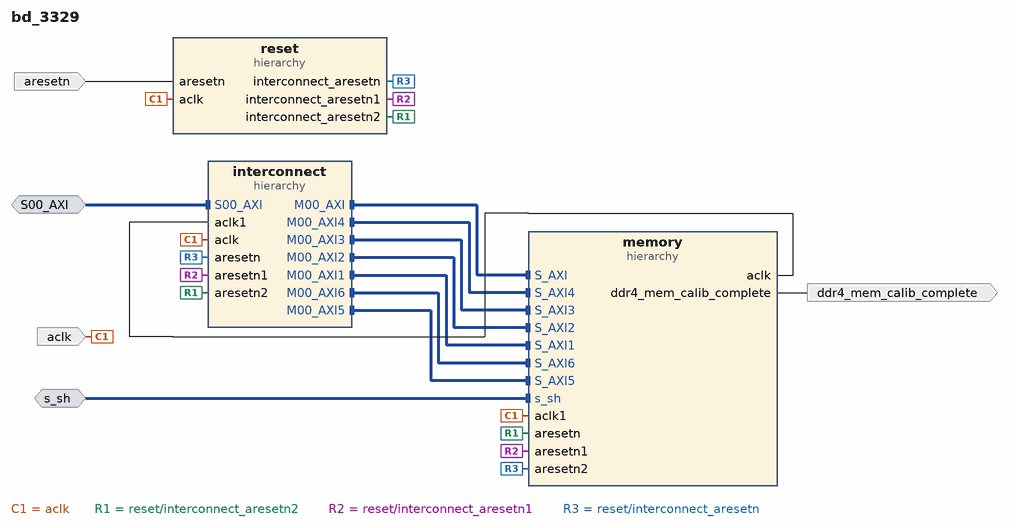
[diagram p0: block diagram of the top level]
# Vivado block design bd_3329, xcvu9p-flgb2104-2-i, Vivado 2019.2
create_bd_design bd_3329

create_bd_intf_port -mode Slave -vlnv xilinx.com:interface:aximm_rtl:1.0 S00_AXI
set_property -dict {CONFIG.ADDR_WIDTH 37 CONFIG.master_id 0} [get_bd_intf_ports S00_AXI]
create_bd_intf_port -mode Slave -vlnv xilinx.com:interface:aws_f1_sh1_rtl:1.0 s_sh
create_bd_port -dir I -type clk aclk
set_property -dict {CONFIG.ASSOCIATED_BUSIF S00_AXI} [get_bd_ports aclk]
create_bd_port -dir I -type rst aresetn
create_bd_port -dir O -type data ddr4_mem_calib_complete

create_bd_cell -type hier reset
create_bd_cell -type hier interconnect
create_bd_cell -type hier memory

# ---- hierarchy /reset ----
current_bd_instance /reset
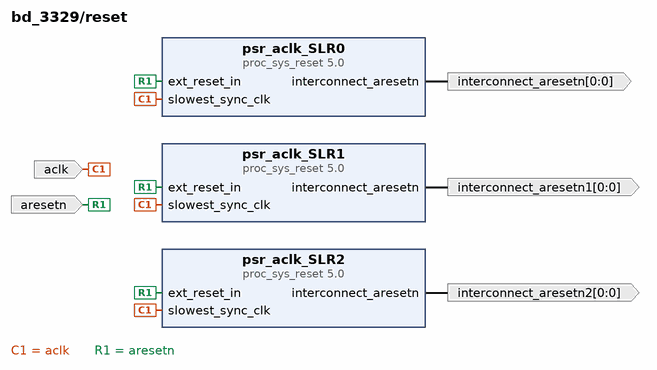
[diagram p1: block diagram inside /reset]
create_bd_pin -dir I -type clk aclk
create_bd_pin -dir I -type rst aresetn
create_bd_pin -dir O -from 0 -to 0 -type rst interconnect_aresetn
create_bd_pin -dir O -from 0 -to 0 -type rst interconnect_aresetn1
create_bd_pin -dir O -from 0 -to 0 -type rst interconnect_aresetn2

create_bd_cell -type ip -vlnv xilinx.com:ip:proc_sys_reset:5.0 psr_aclk_SLR0
set_property -dict {CONFIG.SLR_ASSIGNMENTS SLR0} [get_bd_cells psr_aclk_SLR0]
create_bd_cell -type ip -vlnv xilinx.com:ip:proc_sys_reset:5.0 psr_aclk_SLR1
set_property -dict {CONFIG.SLR_ASSIGNMENTS SLR1} [get_bd_cells psr_aclk_SLR1]
create_bd_cell -type ip -vlnv xilinx.com:ip:proc_sys_reset:5.0 psr_aclk_SLR2
set_property -dict {CONFIG.SLR_ASSIGNMENTS SLR2} [get_bd_cells psr_aclk_SLR2]

# ---- hierarchy /interconnect ----
current_bd_instance /interconnect
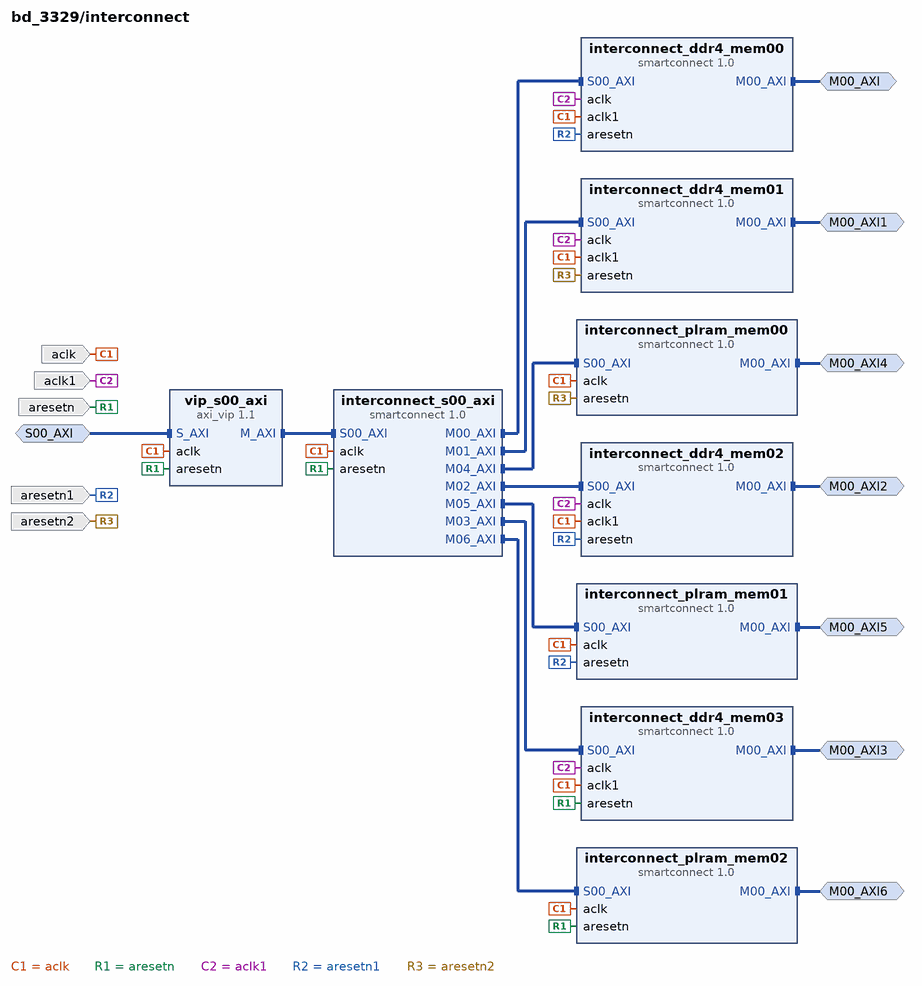
[diagram p2: block diagram inside /interconnect]
create_bd_intf_pin -mode Master -vlnv xilinx.com:interface:aximm_rtl:1.0 M00_AXI
create_bd_intf_pin -mode Master -vlnv xilinx.com:interface:aximm_rtl:1.0 M00_AXI1
create_bd_intf_pin -mode Master -vlnv xilinx.com:interface:aximm_rtl:1.0 M00_AXI2
create_bd_intf_pin -mode Master -vlnv xilinx.com:interface:aximm_rtl:1.0 M00_AXI3
create_bd_intf_pin -mode Master -vlnv xilinx.com:interface:aximm_rtl:1.0 M00_AXI4
create_bd_intf_pin -mode Master -vlnv xilinx.com:interface:aximm_rtl:1.0 M00_AXI5
create_bd_intf_pin -mode Master -vlnv xilinx.com:interface:aximm_rtl:1.0 M00_AXI6
create_bd_intf_pin -mode Slave -vlnv xilinx.com:interface:aximm_rtl:1.0 S00_AXI
create_bd_pin -dir I -type clk aclk
create_bd_pin -dir I -type rst aresetn
create_bd_pin -dir I -type clk aclk1
create_bd_pin -dir I -type rst aresetn1
create_bd_pin -dir I -type rst aresetn2

create_bd_cell -type ip -vlnv xilinx.com:ip:smartconnect:1.0 interconnect_s00_axi
set_property -dict [list \
  CONFIG.ADVANCED_PROPERTIES {__view__ {functional {S00_Buffer {R_SIZE 512 W_SIZE 512}} timing {M00_Buffer {AR_SLR_PIPE 2 AW_SLR_PIPE 2 R_SLR_PIPE 2 W_SLR_PIPE 2 B_SLR_PIPE 2} M01_Buffer {AR_SLR_PIPE 3 AW_SLR_PIPE 3 R_SLR_PIPE 3 W_SLR_PIPE 3 B_SLR_PIPE 3} M02_Buffer {AR_SLR_PIPE 2 AW_SLR_PIPE 2 R_SLR_PIPE 2 W_SLR_PIPE 2 B_SLR_PIPE 2} M04_Buffer {AR_SLR_PIPE 3 AW_SLR_PIPE 3 R_SLR_PIPE 3 W_SLR_PIPE 3 B_SLR_PIPE 3} M05_Buffer {AR_SLR_PIPE 2 AW_SLR_PIPE 2 R_SLR_PIPE 2 W_SLR_PIPE 2 B_SLR_PIPE 2}}}} \
  CONFIG.NUM_MI 7 \
  CONFIG.NUM_SI 1 \
] [get_bd_cells interconnect_s00_axi]
create_bd_cell -type ip -vlnv xilinx.com:ip:smartconnect:1.0 interconnect_ddr4_mem00
set_property -dict [list \
  CONFIG.ADVANCED_PROPERTIES {__view__ {timing {M00_Buffer {R_SLR_PIPE 1 R_M_SEND_PIPE 1} M00_Exit {REGSLICE 0}}}} \
  CONFIG.NUM_CLKS 2 \
  CONFIG.NUM_MI 1 \
  CONFIG.NUM_SI 1 \
] [get_bd_cells interconnect_ddr4_mem00]
create_bd_cell -type ip -vlnv xilinx.com:ip:smartconnect:1.0 interconnect_ddr4_mem01
set_property -dict [list \
  CONFIG.ADVANCED_PROPERTIES {__view__ {timing {M00_Buffer {R_SLR_PIPE 1 R_M_SEND_PIPE 1} M00_Exit {REGSLICE 0}}}} \
  CONFIG.NUM_CLKS 2 \
  CONFIG.NUM_MI 1 \
  CONFIG.NUM_SI 1 \
] [get_bd_cells interconnect_ddr4_mem01]
create_bd_cell -type ip -vlnv xilinx.com:ip:smartconnect:1.0 interconnect_ddr4_mem02
set_property -dict [list \
  CONFIG.ADVANCED_PROPERTIES {__view__ {timing {M00_Buffer {R_SLR_PIPE 1 R_M_SEND_PIPE 1} M00_Exit {REGSLICE 0}}}} \
  CONFIG.NUM_CLKS 2 \
  CONFIG.NUM_MI 1 \
  CONFIG.NUM_SI 1 \
] [get_bd_cells interconnect_ddr4_mem02]
create_bd_cell -type ip -vlnv xilinx.com:ip:smartconnect:1.0 interconnect_ddr4_mem03
set_property -dict [list \
  CONFIG.ADVANCED_PROPERTIES {__view__ {timing {M00_Buffer {R_SLR_PIPE 1 R_M_SEND_PIPE 1} M00_Exit {REGSLICE 0}}}} \
  CONFIG.NUM_CLKS 2 \
  CONFIG.NUM_MI 1 \
  CONFIG.NUM_SI 1 \
] [get_bd_cells interconnect_ddr4_mem03]
create_bd_cell -type ip -vlnv xilinx.com:ip:smartconnect:1.0 interconnect_plram_mem00
set_property -dict [list \
  CONFIG.ADVANCED_PROPERTIES {__view__ {timing {M00_Buffer {R_SLR_PIPE 1 R_M_SEND_PIPE 1} M00_Exit {REGSLICE 0}}}} \
  CONFIG.NUM_CLKS 1 \
  CONFIG.NUM_MI 1 \
  CONFIG.NUM_SI 1 \
] [get_bd_cells interconnect_plram_mem00]
create_bd_cell -type ip -vlnv xilinx.com:ip:smartconnect:1.0 interconnect_plram_mem01
set_property -dict [list \
  CONFIG.ADVANCED_PROPERTIES {__view__ {timing {M00_Buffer {R_SLR_PIPE 1 R_M_SEND_PIPE 1} M00_Exit {REGSLICE 0}}}} \
  CONFIG.NUM_CLKS 1 \
  CONFIG.NUM_MI 1 \
  CONFIG.NUM_SI 1 \
] [get_bd_cells interconnect_plram_mem01]
create_bd_cell -type ip -vlnv xilinx.com:ip:smartconnect:1.0 interconnect_plram_mem02
set_property -dict [list \
  CONFIG.ADVANCED_PROPERTIES {__view__ {timing {M00_Buffer {R_SLR_PIPE 1 R_M_SEND_PIPE 1} M00_Exit {REGSLICE 0}}}} \
  CONFIG.NUM_CLKS 1 \
  CONFIG.NUM_MI 1 \
  CONFIG.NUM_SI 1 \
] [get_bd_cells interconnect_plram_mem02]
create_bd_cell -type ip -vlnv xilinx.com:ip:axi_vip:1.1 vip_s00_axi

# ---- hierarchy /memory ----
current_bd_instance /memory
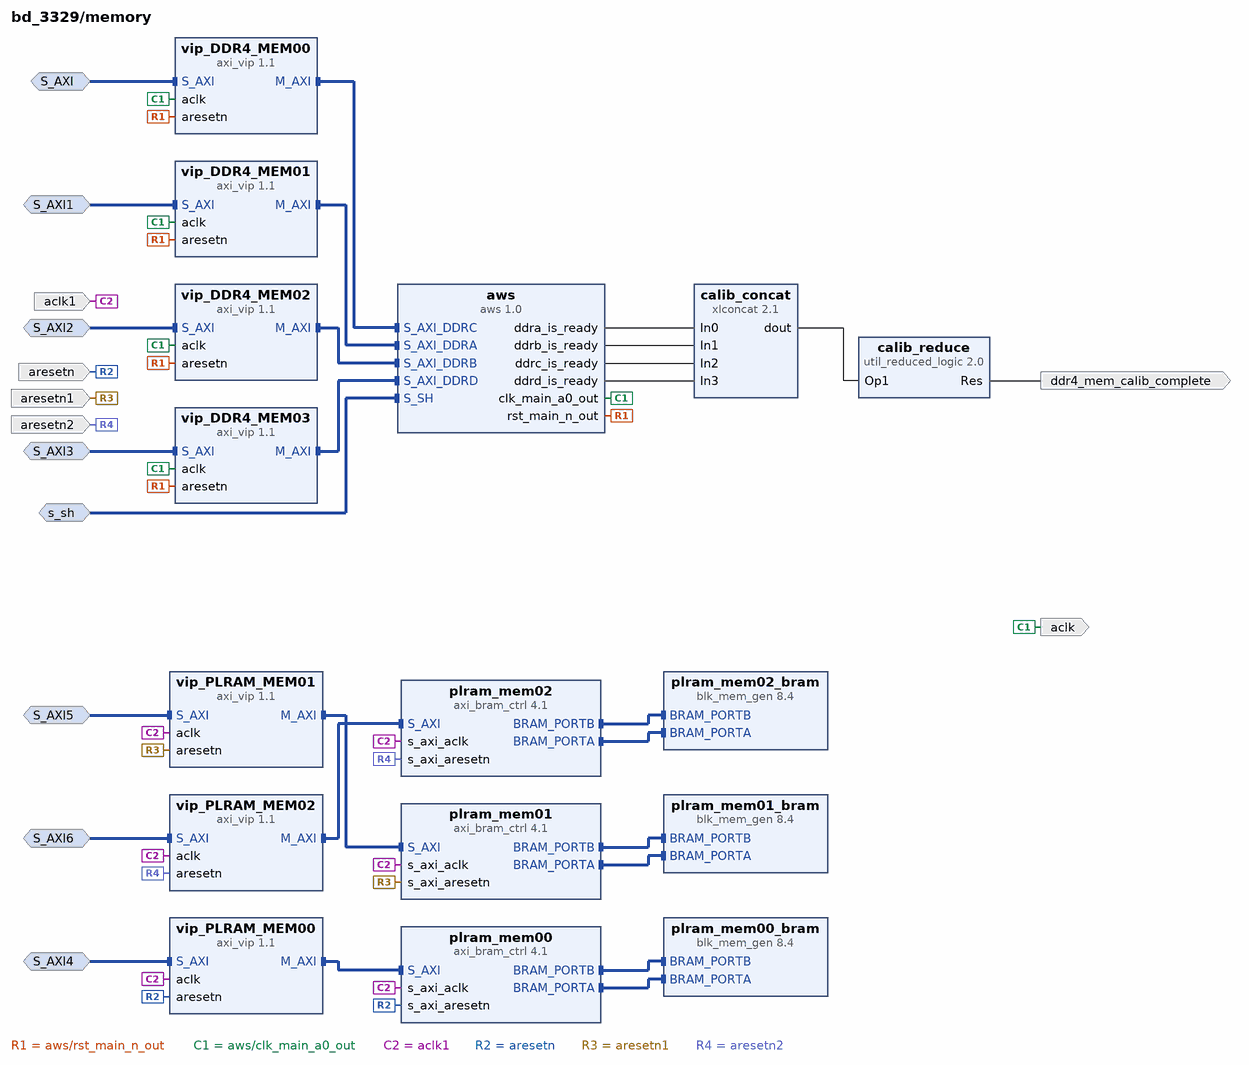
[diagram p3: block diagram inside /memory]
create_bd_intf_pin -mode Slave -vlnv xilinx.com:interface:aws_f1_sh1_rtl:1.0 s_sh
create_bd_intf_pin -mode Slave -vlnv xilinx.com:interface:aximm_rtl:1.0 S_AXI
create_bd_intf_pin -mode Slave -vlnv xilinx.com:interface:aximm_rtl:1.0 S_AXI1
create_bd_intf_pin -mode Slave -vlnv xilinx.com:interface:aximm_rtl:1.0 S_AXI2
create_bd_intf_pin -mode Slave -vlnv xilinx.com:interface:aximm_rtl:1.0 S_AXI3
create_bd_intf_pin -mode Slave -vlnv xilinx.com:interface:aximm_rtl:1.0 S_AXI4
create_bd_intf_pin -mode Slave -vlnv xilinx.com:interface:aximm_rtl:1.0 S_AXI5
create_bd_intf_pin -mode Slave -vlnv xilinx.com:interface:aximm_rtl:1.0 S_AXI6
create_bd_pin -dir O -type clk aclk
create_bd_pin -dir O ddr4_mem_calib_complete
create_bd_pin -dir I -type clk aclk1
create_bd_pin -dir I -type rst aresetn
create_bd_pin -dir I -type rst aresetn1
create_bd_pin -dir I -type rst aresetn2

create_bd_cell -type ip -vlnv xilinx.com:ip:aws:1.0 aws
set_property -dict [list \
  CONFIG.DDR_A_PRESENT 1 \
  CONFIG.DDR_B_PRESENT 1 \
  CONFIG.DDR_C_PRESENT 1 \
  CONFIG.DDR_D_PRESENT 1 \
  CONFIG.MODE 1 \
] [get_bd_cells aws]
create_bd_cell -type ip -vlnv xilinx.com:ip:xlconcat:2.1 calib_concat
set_property -dict {CONFIG.NUM_PORTS 4} [get_bd_cells calib_concat]
create_bd_cell -type ip -vlnv xilinx.com:ip:util_reduced_logic:2.0 calib_reduce
set_property -dict {CONFIG.C_OPERATION and CONFIG.C_SIZE 4} [get_bd_cells calib_reduce]
create_bd_cell -type ip -vlnv xilinx.com:ip:axi_bram_ctrl:4.1 plram_mem00
set_property -dict {CONFIG.DATA_WIDTH 512 CONFIG.SLR_ASSIGNMENTS SLR2} [get_bd_cells plram_mem00]
create_bd_cell -type ip -vlnv xilinx.com:ip:blk_mem_gen:8.4 plram_mem00_bram
set_property -dict {CONFIG.Memory_Type True_Dual_Port_RAM CONFIG.SLR_ASSIGNMENTS SLR2} [get_bd_cells plram_mem00_bram]
create_bd_cell -type ip -vlnv xilinx.com:ip:axi_bram_ctrl:4.1 plram_mem01
set_property -dict {CONFIG.DATA_WIDTH 512 CONFIG.SLR_ASSIGNMENTS SLR1} [get_bd_cells plram_mem01]
create_bd_cell -type ip -vlnv xilinx.com:ip:blk_mem_gen:8.4 plram_mem01_bram
set_property -dict {CONFIG.Memory_Type True_Dual_Port_RAM CONFIG.SLR_ASSIGNMENTS SLR1} [get_bd_cells plram_mem01_bram]
create_bd_cell -type ip -vlnv xilinx.com:ip:axi_bram_ctrl:4.1 plram_mem02
set_property -dict {CONFIG.DATA_WIDTH 512 CONFIG.SLR_ASSIGNMENTS SLR0} [get_bd_cells plram_mem02]
create_bd_cell -type ip -vlnv xilinx.com:ip:blk_mem_gen:8.4 plram_mem02_bram
set_property -dict {CONFIG.Memory_Type True_Dual_Port_RAM CONFIG.SLR_ASSIGNMENTS SLR0} [get_bd_cells plram_mem02_bram]
create_bd_cell -type ip -vlnv xilinx.com:ip:axi_vip:1.1 vip_DDR4_MEM00
create_bd_cell -type ip -vlnv xilinx.com:ip:axi_vip:1.1 vip_DDR4_MEM01
create_bd_cell -type ip -vlnv xilinx.com:ip:axi_vip:1.1 vip_DDR4_MEM02
create_bd_cell -type ip -vlnv xilinx.com:ip:axi_vip:1.1 vip_DDR4_MEM03
create_bd_cell -type ip -vlnv xilinx.com:ip:axi_vip:1.1 vip_PLRAM_MEM00
create_bd_cell -type ip -vlnv xilinx.com:ip:axi_vip:1.1 vip_PLRAM_MEM01
create_bd_cell -type ip -vlnv xilinx.com:ip:axi_vip:1.1 vip_PLRAM_MEM02

# ---- connections ----

current_bd_instance /reset
connect_bd_net [get_bd_pins aclk] \
  [get_bd_pins psr_aclk_SLR1/slowest_sync_clk] [get_bd_pins psr_aclk_SLR2/slowest_sync_clk] \
  [get_bd_pins psr_aclk_SLR0/slowest_sync_clk]
connect_bd_net [get_bd_pins aresetn] \
  [get_bd_pins psr_aclk_SLR1/ext_reset_in] [get_bd_pins psr_aclk_SLR2/ext_reset_in] [get_bd_pins psr_aclk_SLR0/ext_reset_in]
connect_bd_net [get_bd_pins psr_aclk_SLR0/interconnect_aresetn] [get_bd_pins interconnect_aresetn]
connect_bd_net [get_bd_pins psr_aclk_SLR1/interconnect_aresetn] [get_bd_pins interconnect_aresetn1]
connect_bd_net [get_bd_pins psr_aclk_SLR2/interconnect_aresetn] [get_bd_pins interconnect_aresetn2]

current_bd_instance /interconnect
connect_bd_intf_net [get_bd_intf_pins interconnect_s00_axi/S00_AXI] [get_bd_intf_pins vip_s00_axi/M_AXI]
connect_bd_intf_net [get_bd_intf_pins M00_AXI4] [get_bd_intf_pins interconnect_plram_mem00/M00_AXI]
connect_bd_intf_net [get_bd_intf_pins S00_AXI] [get_bd_intf_pins vip_s00_axi/S_AXI]
connect_bd_intf_net [get_bd_intf_pins M00_AXI6] [get_bd_intf_pins interconnect_plram_mem02/M00_AXI]
connect_bd_intf_net [get_bd_intf_pins M00_AXI1] [get_bd_intf_pins interconnect_ddr4_mem01/M00_AXI]
connect_bd_intf_net [get_bd_intf_pins M00_AXI2] [get_bd_intf_pins interconnect_ddr4_mem02/M00_AXI]
connect_bd_intf_net [get_bd_intf_pins M00_AXI3] [get_bd_intf_pins interconnect_ddr4_mem03/M00_AXI]
connect_bd_intf_net [get_bd_intf_pins M00_AXI] [get_bd_intf_pins interconnect_ddr4_mem00/M00_AXI]
connect_bd_intf_net [get_bd_intf_pins M00_AXI5] [get_bd_intf_pins interconnect_plram_mem01/M00_AXI]
connect_bd_intf_net [get_bd_intf_pins interconnect_s00_axi/M05_AXI] [get_bd_intf_pins interconnect_plram_mem01/S00_AXI]
connect_bd_intf_net [get_bd_intf_pins interconnect_s00_axi/M06_AXI] [get_bd_intf_pins interconnect_plram_mem02/S00_AXI]
connect_bd_intf_net [get_bd_intf_pins interconnect_s00_axi/M02_AXI] [get_bd_intf_pins interconnect_ddr4_mem02/S00_AXI]
connect_bd_intf_net [get_bd_intf_pins interconnect_s00_axi/M03_AXI] [get_bd_intf_pins interconnect_ddr4_mem03/S00_AXI]
connect_bd_intf_net [get_bd_intf_pins interconnect_s00_axi/M04_AXI] [get_bd_intf_pins interconnect_plram_mem00/S00_AXI]
connect_bd_intf_net [get_bd_intf_pins interconnect_s00_axi/M00_AXI] [get_bd_intf_pins interconnect_ddr4_mem00/S00_AXI]
connect_bd_intf_net [get_bd_intf_pins interconnect_s00_axi/M01_AXI] [get_bd_intf_pins interconnect_ddr4_mem01/S00_AXI]
connect_bd_net [get_bd_pins aclk] \
  [get_bd_pins interconnect_ddr4_mem00/aclk1] [get_bd_pins interconnect_ddr4_mem01/aclk1] \
  [get_bd_pins interconnect_ddr4_mem02/aclk1] [get_bd_pins interconnect_ddr4_mem03/aclk1] \
  [get_bd_pins interconnect_plram_mem00/aclk] [get_bd_pins interconnect_plram_mem01/aclk] \
  [get_bd_pins interconnect_plram_mem02/aclk] [get_bd_pins vip_s00_axi/aclk] [get_bd_pins interconnect_s00_axi/aclk]
connect_bd_net -net psr_aclk_SLR0_interconnect_aresetn [get_bd_pins aresetn] \
  [get_bd_pins interconnect_ddr4_mem03/aresetn] [get_bd_pins interconnect_plram_mem02/aresetn] \
  [get_bd_pins vip_s00_axi/aresetn] [get_bd_pins interconnect_s00_axi/aresetn]
connect_bd_net -net aws_clk_main_a0_out [get_bd_pins aclk1] \
  [get_bd_pins interconnect_ddr4_mem01/aclk] [get_bd_pins interconnect_ddr4_mem02/aclk] \
  [get_bd_pins interconnect_ddr4_mem03/aclk] [get_bd_pins interconnect_ddr4_mem00/aclk]
connect_bd_net -net psr_aclk_SLR1_interconnect_aresetn [get_bd_pins aresetn1] \
  [get_bd_pins interconnect_ddr4_mem02/aresetn] [get_bd_pins interconnect_plram_mem01/aresetn] \
  [get_bd_pins interconnect_ddr4_mem00/aresetn]
connect_bd_net -net psr_aclk_SLR2_interconnect_aresetn [get_bd_pins aresetn2] \
  [get_bd_pins interconnect_plram_mem00/aresetn] [get_bd_pins interconnect_ddr4_mem01/aresetn]

current_bd_instance /memory
connect_bd_intf_net [get_bd_intf_pins aws/S_AXI_DDRC] [get_bd_intf_pins vip_DDR4_MEM00/M_AXI]
connect_bd_intf_net [get_bd_intf_pins plram_mem00/S_AXI] [get_bd_intf_pins vip_PLRAM_MEM00/M_AXI]
connect_bd_intf_net [get_bd_intf_pins aws/S_AXI_DDRD] [get_bd_intf_pins vip_DDR4_MEM03/M_AXI]
connect_bd_intf_net [get_bd_intf_pins aws/S_AXI_DDRB] [get_bd_intf_pins vip_DDR4_MEM02/M_AXI]
connect_bd_intf_net [get_bd_intf_pins aws/S_AXI_DDRA] [get_bd_intf_pins vip_DDR4_MEM01/M_AXI]
connect_bd_intf_net [get_bd_intf_pins plram_mem02/S_AXI] [get_bd_intf_pins vip_PLRAM_MEM02/M_AXI]
connect_bd_intf_net -intf_net interconnect_plram_mem02_M00_AXI [get_bd_intf_pins S_AXI6] [get_bd_intf_pins vip_PLRAM_MEM02/S_AXI]
connect_bd_intf_net -intf_net interconnect_ddr4_mem03_M00_AXI [get_bd_intf_pins S_AXI3] [get_bd_intf_pins vip_DDR4_MEM03/S_AXI]
connect_bd_intf_net -intf_net interconnect_plram_mem01_M00_AXI [get_bd_intf_pins S_AXI5] [get_bd_intf_pins vip_PLRAM_MEM01/S_AXI]
connect_bd_intf_net -intf_net interconnect_ddr4_mem01_M00_AXI [get_bd_intf_pins S_AXI1] [get_bd_intf_pins vip_DDR4_MEM01/S_AXI]
connect_bd_intf_net -intf_net interconnect_ddr4_mem02_M00_AXI [get_bd_intf_pins S_AXI2] [get_bd_intf_pins vip_DDR4_MEM02/S_AXI]
connect_bd_intf_net [get_bd_intf_pins s_sh] [get_bd_intf_pins aws/S_SH]
connect_bd_intf_net -intf_net interconnect_ddr4_mem00_M00_AXI [get_bd_intf_pins S_AXI] [get_bd_intf_pins vip_DDR4_MEM00/S_AXI]
connect_bd_intf_net -intf_net interconnect_plram_mem00_M00_AXI [get_bd_intf_pins S_AXI4] [get_bd_intf_pins vip_PLRAM_MEM00/S_AXI]
connect_bd_intf_net [get_bd_intf_pins plram_mem01/S_AXI] [get_bd_intf_pins vip_PLRAM_MEM01/M_AXI]
connect_bd_intf_net [get_bd_intf_pins plram_mem02_bram/BRAM_PORTB] [get_bd_intf_pins plram_mem02/BRAM_PORTB]
connect_bd_intf_net [get_bd_intf_pins plram_mem02_bram/BRAM_PORTA] [get_bd_intf_pins plram_mem02/BRAM_PORTA]
connect_bd_intf_net [get_bd_intf_pins plram_mem01_bram/BRAM_PORTB] [get_bd_intf_pins plram_mem01/BRAM_PORTB]
connect_bd_intf_net [get_bd_intf_pins plram_mem01_bram/BRAM_PORTA] [get_bd_intf_pins plram_mem01/BRAM_PORTA]
connect_bd_intf_net [get_bd_intf_pins plram_mem00_bram/BRAM_PORTB] [get_bd_intf_pins plram_mem00/BRAM_PORTB]
connect_bd_intf_net [get_bd_intf_pins plram_mem00_bram/BRAM_PORTA] [get_bd_intf_pins plram_mem00/BRAM_PORTA]
connect_bd_net [get_bd_pins aws/rst_main_n_out] \
  [get_bd_pins vip_DDR4_MEM00/aresetn] [get_bd_pins vip_DDR4_MEM01/aresetn] [get_bd_pins vip_DDR4_MEM02/aresetn] \
  [get_bd_pins vip_DDR4_MEM03/aresetn]
connect_bd_net [get_bd_pins aws/ddra_is_ready] [get_bd_pins calib_concat/In0]
connect_bd_net [get_bd_pins aws/ddrb_is_ready] [get_bd_pins calib_concat/In1]
connect_bd_net [get_bd_pins aws/ddrc_is_ready] [get_bd_pins calib_concat/In2]
connect_bd_net [get_bd_pins aws/ddrd_is_ready] [get_bd_pins calib_concat/In3]
connect_bd_net [get_bd_pins calib_concat/dout] [get_bd_pins calib_reduce/Op1]
connect_bd_net [get_bd_pins aws/clk_main_a0_out] \
  [get_bd_pins aclk] [get_bd_pins vip_DDR4_MEM00/aclk] [get_bd_pins vip_DDR4_MEM01/aclk] [get_bd_pins vip_DDR4_MEM02/aclk] \
  [get_bd_pins vip_DDR4_MEM03/aclk]
connect_bd_net [get_bd_pins calib_reduce/Res] [get_bd_pins ddr4_mem_calib_complete]
connect_bd_net [get_bd_pins aclk1] \
  [get_bd_pins plram_mem01/s_axi_aclk] [get_bd_pins plram_mem02/s_axi_aclk] [get_bd_pins vip_PLRAM_MEM00/aclk] \
  [get_bd_pins vip_PLRAM_MEM01/aclk] [get_bd_pins vip_PLRAM_MEM02/aclk] [get_bd_pins plram_mem00/s_axi_aclk]
connect_bd_net -net psr_aclk_SLR2_interconnect_aresetn [get_bd_pins aresetn] \
  [get_bd_pins vip_PLRAM_MEM00/aresetn] [get_bd_pins plram_mem00/s_axi_aresetn]
connect_bd_net -net psr_aclk_SLR1_interconnect_aresetn [get_bd_pins aresetn1] \
  [get_bd_pins vip_PLRAM_MEM01/aresetn] [get_bd_pins plram_mem01/s_axi_aresetn]
connect_bd_net -net psr_aclk_SLR0_interconnect_aresetn [get_bd_pins aresetn2] \
  [get_bd_pins vip_PLRAM_MEM02/aresetn] [get_bd_pins plram_mem02/s_axi_aresetn]

current_bd_instance /
connect_bd_intf_net -intf_net interconnect_ddr4_mem00_M00_AXI [get_bd_intf_pins interconnect/M00_AXI] [get_bd_intf_pins memory/S_AXI]
connect_bd_intf_net -intf_net interconnect_plram_mem00_M00_AXI [get_bd_intf_pins interconnect/M00_AXI4] [get_bd_intf_pins memory/S_AXI4]
connect_bd_intf_net -intf_net interconnect_ddr4_mem03_M00_AXI [get_bd_intf_pins interconnect/M00_AXI3] [get_bd_intf_pins memory/S_AXI3]
connect_bd_intf_net -intf_net interconnect_ddr4_mem02_M00_AXI [get_bd_intf_pins interconnect/M00_AXI2] [get_bd_intf_pins memory/S_AXI2]
connect_bd_intf_net -intf_net interconnect_ddr4_mem01_M00_AXI [get_bd_intf_pins interconnect/M00_AXI1] [get_bd_intf_pins memory/S_AXI1]
connect_bd_intf_net -intf_net interconnect_plram_mem02_M00_AXI [get_bd_intf_pins interconnect/M00_AXI6] [get_bd_intf_pins memory/S_AXI6]
connect_bd_intf_net -intf_net interconnect_plram_mem01_M00_AXI [get_bd_intf_pins interconnect/M00_AXI5] [get_bd_intf_pins memory/S_AXI5]
connect_bd_intf_net [get_bd_intf_ports S00_AXI] [get_bd_intf_pins interconnect/S00_AXI]
connect_bd_intf_net [get_bd_intf_ports s_sh] [get_bd_intf_pins memory/s_sh]
connect_bd_net [get_bd_ports aresetn] [get_bd_pins reset/aresetn]
connect_bd_net [get_bd_ports aclk] [get_bd_pins reset/aclk] [get_bd_pins interconnect/aclk] [get_bd_pins memory/aclk1]
connect_bd_net -net calib_reduce_Res [get_bd_pins memory/ddr4_mem_calib_complete] [get_bd_ports ddr4_mem_calib_complete]
connect_bd_net -net psr_aclk_SLR2_interconnect_aresetn [get_bd_pins reset/interconnect_aresetn2] \
  [get_bd_pins interconnect/aresetn2] [get_bd_pins memory/aresetn]
connect_bd_net -net psr_aclk_SLR1_interconnect_aresetn [get_bd_pins reset/interconnect_aresetn1] \
  [get_bd_pins interconnect/aresetn1] [get_bd_pins memory/aresetn1]
connect_bd_net -net psr_aclk_SLR0_interconnect_aresetn [get_bd_pins reset/interconnect_aresetn] \
  [get_bd_pins interconnect/aresetn] [get_bd_pins memory/aresetn2]
connect_bd_net -net aws_clk_main_a0_out [get_bd_pins memory/aclk] [get_bd_pins interconnect/aclk1]

# ---- address map ----
assign_bd_address -offset 0x0000000000 -range 16G -target_address_space [get_bd_addr_spaces S00_AXI] [get_bd_addr_segs memory/aws/S_AXI_DDRA/Mem_DDRA]
assign_bd_address -offset 0x0400000000 -range 16G -target_address_space [get_bd_addr_spaces S00_AXI] [get_bd_addr_segs memory/aws/S_AXI_DDRB/Mem_DDRB]
assign_bd_address -offset 0x0800000000 -range 16G -target_address_space [get_bd_addr_spaces S00_AXI] [get_bd_addr_segs memory/aws/S_AXI_DDRC/Mem_DDRC]
assign_bd_address -offset 0x0C00000000 -range 16G -target_address_space [get_bd_addr_spaces S00_AXI] [get_bd_addr_segs memory/aws/S_AXI_DDRD/Mem_DDRD]
assign_bd_address -offset 0x1000000000 -range 128K -target_address_space [get_bd_addr_spaces S00_AXI] [get_bd_addr_segs memory/plram_mem00/S_AXI/Mem0]
assign_bd_address -offset 0x1000200000 -range 128K -target_address_space [get_bd_addr_spaces S00_AXI] [get_bd_addr_segs memory/plram_mem01/S_AXI/Mem0]
assign_bd_address -offset 0x1000400000 -range 128K -target_address_space [get_bd_addr_spaces S00_AXI] [get_bd_addr_segs memory/plram_mem02/S_AXI/Mem0]

validate_bd_design
save_bd_design
